# EAGLE schematic minirov (EAGLE 9.1.3)
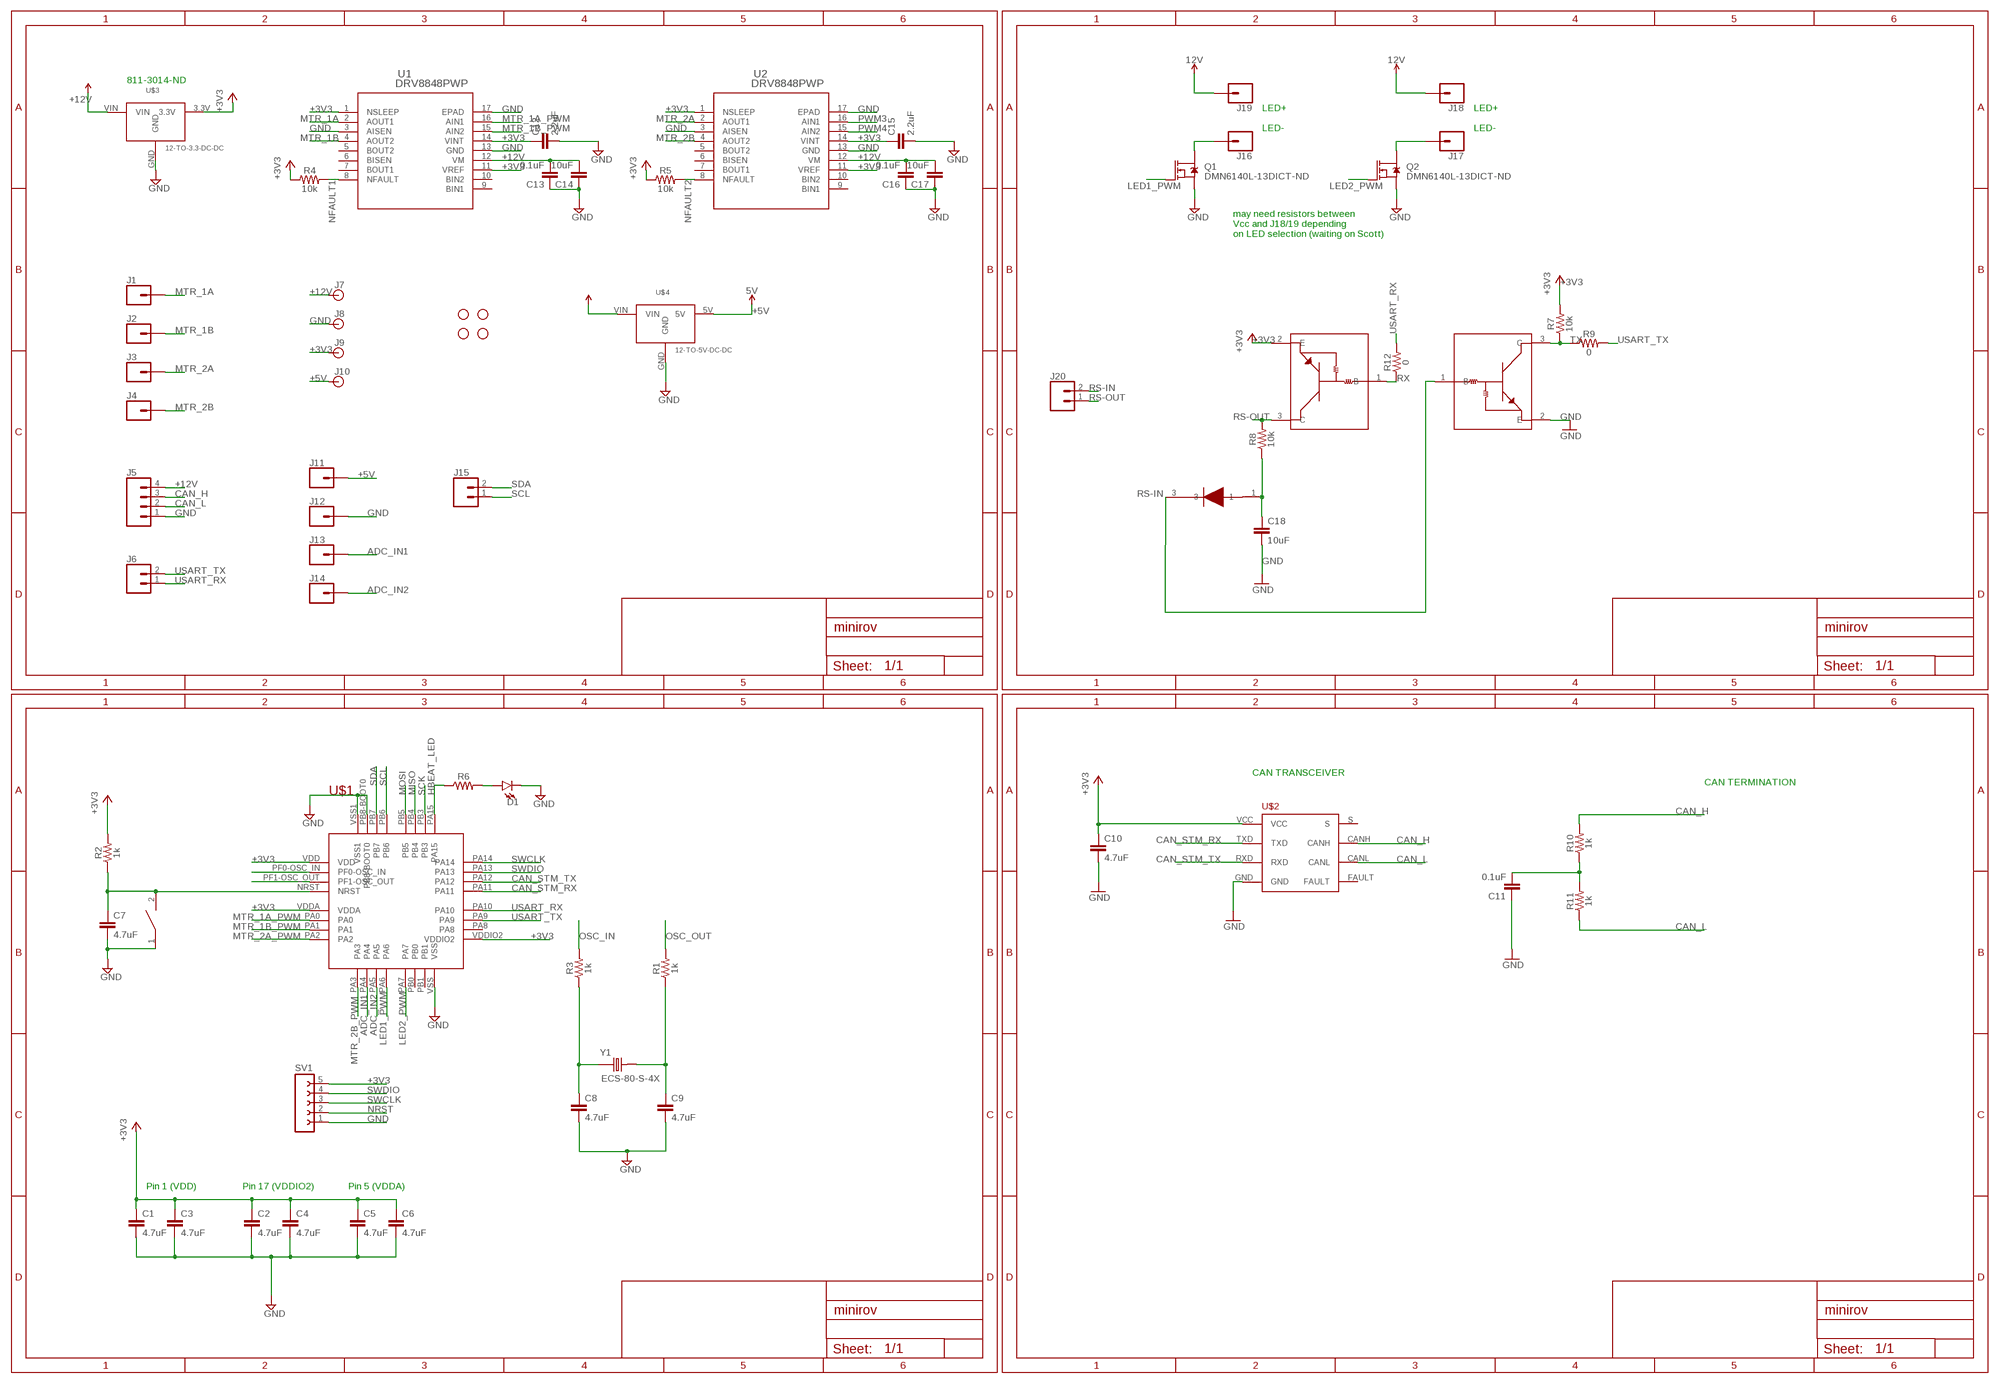
[diagram p0: schematic, sheet 1]

## Parts
C1  4.7uF  4.7UF0603  [0603]
C2  4.7uF  4.7UF0603  [0603]
C3  4.7uF  4.7UF0603  [0603]
C4  4.7uF  4.7UF0603  [0603]
C5  4.7uF  4.7UF0603  [0603]
C6  4.7uF  4.7UF0603  [0603]
C7  4.7uF  4.7UF0603  [0603]
C8  4.7uF  4.7UF0603  [0603]
C9  4.7uF  4.7UF0603  [0603]
C10  4.7uF  4.7UF0603  [0603]
C11  0.1uF  0.1UF-0603-25V-(+80/-20%)  [0603]
C12  2.2uF  0.1UF-0603-25V-(+80/-20%)  [0603]
C13  0.1uF  0.1UF-0603-25V-(+80/-20%)  [0603]
C14  10uF  0.1UF-0603-25V-(+80/-20%)  [0603]
C15  2.2uF  0.1UF-0603-25V-(+80/-20%)  [0603]
C16  0.1uF  0.1UF-0603-25V-(+80/-20%)  [0603]
C17  10uF  0.1UF-0603-25V-(+80/-20%)  [0603]
C18  10uF  10UF-0603-6.3V-20%  [0603]
D1  LED0603  [LED-0603]
H1  STAND-OFF  [STAND-OFF]
H2  STAND-OFF  [STAND-OFF]
H3  STAND-OFF  [STAND-OFF]
H4  STAND-OFF  [STAND-OFF]
J1  CONN_01  [1X01]
J2  CONN_01  [1X01]
J3  CONN_01  [1X01]
J4  CONN_01  [1X01]
J5  CONN_04  [1X04]
J6  CONN_02  [1X02]
J7  BANANA_CONN  [BANANA_CONN]
J8  BANANA_CONN  [BANANA_CONN]
J9  BANANA_CONN  [BANANA_CONN]
J10  BANANA_CONN  [BANANA_CONN]
J11  CONN_01  [1X01]
J12  CONN_01  [1X01]
J13  CONN_01  [1X01]
J14  CONN_01  [1X01]
J15  CONN_02  [1X02]
J16  CONN_01  [1X01]
J17  CONN_01  [1X01]
J18  CONN_01  [1X01]
J19  CONN_01  [1X01]
J20  CONN_02  [1X02]
Q1  DMN6140L-13DICT-ND  DMN6140L-13  [SOT23-3]
Q2  DMN6140L-13DICT-ND  DMN6140L-13  [SOT23-3]
R1  1k  1KOHM-0603-1/10W-1%  [0603]
R2  1k  1KOHM-0603-1/10W-1%  [0603]
R3  1k  1KOHM-0603-1/10W-1%  [0603]
R4  10k  RESISTOR0603  [0603]
R5  10k  RESISTOR0603  [0603]
R6  RESISTOR0603  [0603]
R7  10k  RESISTOR0603  [0603]
R8  10k  RESISTOR0603  [0603]
R9  0  RESISTOR0603  [0603]
R10  1k  1KOHM-0603-1/10W-1%  [0603]
R11  1k  1KOHM-0603-1/10W-1%  [0603]
R12  0  RESISTOR0603  [0603]
RESET  SWITCH  [SW_2512]
SV1  FE05-1  [FE05-1]
U1  DRV8848PWP  [PWP16_2P46X2P31]
U2  DRV8848PWP  [PWP16_2P46X2P31]
U$1  STM32F042K6T6  [STM32F042K6T6]
U$2  TCAN337D  [TCAN337D]
U$3  12-TO-3.3-DC-DC  [MURATA-DCDC]
U$4  12-TO-5V-DC-DC  [MURATA-DCDC_5V]
U$5  UN2112  [SOT23-3]
U$6  UN2212  [SOT23-3]
U$7  BAS16  [BAS16]
Y1  ECS-80-S-4X  [XTAL_ECS-80-S-4X]

## Nets
12V: U$4.VIN
+3V3: C1.1 C2.1 C3.1 C4.1 C5.1 C6.1 C10.1 C12.1 C15.1 J9.P$1 R2.2 R4.1 R5.1 R7.2 SV1.5 U1.1(NSLEEP) U1.11(VREF) U1.14(VINT) U2.1(NSLEEP) U2.11(VREF) U2.14(VINT) U$1.VDD U$1.VDDA U$1.VDDIO2 U$2.VCC U$3.3.3V U$5.2(E)
+5V: J10.P$1 J11.1 U$4.5V ; supply symbol labelled 5V
+12V: C13.2 C14.2 C16.2 C17.2 J5.4 J7.P$1 J18.1 J19.1 U1.12(VM) U2.12(VM) U$3.VIN ; supply symbol labelled 12V
ADC_IN1: J13.1 U$1.PA4
ADC_IN2: J14.1 U$1.PA5
CAN_H: J5.3 R10.2 U$2.CANH
CAN_L: J5.2 R11.1 U$2.CANL
CAN_STM_RX: U$1.PA11 U$2.TXD
CAN_STM_TX: U$1.PA12 U$2.RXD
GND: C1.2 C2.2 C3.2 C4.2 C5.2 C6.2 C7.2 C8.2 C9.2 C10.2 C11.1 C12.2 C13.1 C14.1 C15.2 C16.1 C17.1 C18.2 D1.C J5.1 J8.P$1 J12.1 Q1.2(S) Q2.2(S) RESET.1 SV1.1 U1.3(AISEN) U1.13(GND) U1.17(EPAD) U2.3(AISEN) U2.13(GND) U2.17(EPAD) U$1.PB8-BOOT0 U$1.VSS U$1.VSS1 U$2.GND U$3.GND U$4.GND U$6.2(E)
HBEAT_LED: R6.1 U$1.PA15
LED1_PWM: Q1.1(G) U$1.PA6
LED2_PWM: Q2.1(G) U$1.PA7
MISO: U$1.PB4
MOSI: U$1.PB5
MTR_1A: J1.1 U1.2(AOUT1)
MTR_1A_PWM: U1.16(AIN1) U$1.PA0
MTR_1B: J2.1 U1.4(AOUT2)
MTR_1B_PWM: U1.15(AIN2) U$1.PA1
MTR_2A: J3.1 U2.2(AOUT1)
MTR_2A_PWM: U$1.PA2
MTR_2B: J4.1 U2.4(AOUT2)
MTR_2B_PWM: U$1.PA3
N$1: C9.1 R1.1 Y1.2
N$2: C8.1 R3.1 Y1.1
N$3: C11.2 R10.1 R11.2
N$4: D1.A R6.2
N$5: C18.1 R8.1 U$7.1
N$6: J17.1 Q2.3(D)
N$7: J16.1 Q1.3(D)
NFAULT1: R4.2 U1.8(NFAULT)
NFAULT2: R5.2 U2.8(NFAULT)
NRST: C7.1 R2.1 RESET.2 SV1.2 U$1.NRST
OSC_IN: R3.2 U$1.PF0-OSC_IN
OSC_OUT: R1.2 U$1.PF1-OSC_OUT
PWM3: U2.16(AIN1)
PWM4: U2.15(AIN2)
RS-IN: J20.2 U$6.1(B) U$7.3
RS-OUT: J20.1 R8.2 U$5.3(C)
RX: R12.1 U$5.1(B)
SCK: U$1.PB3
SCL: J15.1 U$1.PB6
SDA: J15.2 U$1.PB7
SWCLK: SV1.3 U$1.PA14
SWDIO: SV1.4 U$1.PA13
TX: R7.1 R9.1 U$6.3(C)
USART_RX: J6.1 R12.2 U$1.PA10
USART_TX: J6.2 R9.2 U$1.PA9
Unconnected: U1.5(BOUT2) U1.6(BISEN) U1.7(BOUT1) U1.9(BIN1) U1.10(BIN2) U2.5(BOUT2) U2.6(BISEN) U2.7(BOUT1) U2.9(BIN1) U2.10(BIN2) U$1.PA8 U$1.PB0 U$1.PB1 U$2.FAULT U$2.S

## Notes on the sheet
- 811-3014-ND
- LED+
  
  LED-
- LED+
  
  LED-
- may need resistors between 
  Vcc and J18/19 depending 
  on LED selection (waiting on Scott)
- CAN TRANSCEIVER
- CAN TERMINATION
- Pin 1 (VDD) | Pin 17 (VDDIO2) | Pin 5 (VDDA)

## Library data of the parts
C1-C10 = SparkFun-Capacitors:4.7UF: 4.7µF ceramic capacitors A capacitor is a passive two-terminal electrical component used to store electrical energy temporarily in an electric field.; PROD_ID: CAP-08280
C11 C13 C16 = SparkFun-Capacitors:0.1UF: 0.1µF ceramic capacitors A capacitor is a passive two-terminal electrical component used to store electrical energy temporarily in an electric field.; PROD_ID: CAP-00810
C12 C14 C15 C17 = SparkFun-Capacitors:0.1UF: 0.1µF ceramic capacitors A capacitor is a passive two-terminal electrical component used to store electrical energy temporarily in an electric field.; PROD_ID: CAP-00810; VALUE: 0.1uF
C18 = SparkFun-Capacitors:10UF: 10.0µF ceramic capacitors A capacitor is a passive two-terminal electrical component used to store electrical energy temporarily in an electric field.; PROD_ID: CAP-11015
D1 = SparkFun-LED:LED: LED (Generic) Standard schematic elements and footprints for 5mm, 3mm, 1206, and 0603 sized LEDs. Generic LEDs with no color specified.
H1-H4 = SparkFun-Hardware:STAND-OFF: Stand Off Drill holes for mechanically mounting via screws, standoffs, etc. Note: Use the keepout ring to avoid running the screw head into surrounding components. Variant Overviews STAND-OFF - Mechanical footprint for a #4 phillips button head screw. STAND-OFF-TIGHT - Mechanical footprint for a #4 phillips button head screw, Example SparkFun Products Screw - Phillips Head (1/4", 4-40, 10 pack) <https://www.sparkfun.com/products/10453> (PRT-10453) Screw - Phillips Head (1/2", 4-40, 10 pack) <https://www.sparkfun.com/products/10452> (PRT-10452) Screw - Phillips Head (3/4", 4-40, 10 pack) <https://www.sparkfun.com/products/10451> (PRT-10451) Screw - Phillips Head (1", 4-40, 10 pack) <https://www.sparkfun.com/products/10450> (PRT-10450)
J1-J4 J11-J14 J16-J19 = SparkFun-Connectors:CONN_01: Single connection point. Often used as Generic Header-pin footprint for 0.1 inch spaced/style header connections On any of the 0.1 inch spaced packages, you can populate with these: Break Away Headers - Straight <https://www.sparkfun.com/products/116> (PRT-00116) Break Away Male Headers - Right Angle <https://www.sparkfun.com/products/553> (PRT-00553) Female Headers <https://www.sparkfun.com/products/115> (PRT-00115) Break Away Headers - Machine Pin <https://www.sparkfun.com/products/117> (PRT-00117) Break Away Female Headers - Swiss Machine Pin <https://www.sparkfun.com/products/743> (PRT-00743) This device is also useful as a general connection point to wire up your design to another part of your project. Our various solder wires solder well into these plated through hole pads. Hook-Up Wire - Assortment (Stranded, 22 AWG) <https://www.sparkfun.com/products/11375> (PRT-11375) Hook-Up Wire - Assortment (Solid Core, 22 AWG) <https://www.sparkfun.com/products/11367> (PRT-11367) View the entire wire category on our website here <https://www.sparkfun.com/categories/141> Special notes: SMTSO-256-ET is a "flush mount" nut for a 4-40 screw. We mostly use this on specialty testbeds; it is a nice way to connect hardware to your PCB at an adjustable hieght. Also note, the SNAP packages are for using a snappable style connector. We sell a baggie of snaps and they are also used on two LilyPad designs: Snap Assortment - 30 pack (male and female) <https://www.sparkfun.com/products/11347> (DEV-11347) LilyPad Arduino SimpleSnap <https://www.sparkfun.com/products/10941> (DEV-10941) LilyPad SimpleSnap Protoboard <https://www.sparkfun.com/products/10940> (DEV-10940)
J5 = SparkFun-Connectors:CONN_04: Multi connection point. Often used as Generic Header-pin footprint for 0.1 inch spaced/style header connections On any of the 0.1 inch spaced packages, you can populate with these: Break Away Headers - Straight <https://www.sparkfun.com/products/116> (PRT-00116) Break Away Male Headers - Right Angle <https://www.sparkfun.com/products/553> (PRT-00553) Female Headers <https://www.sparkfun.com/products/115> (PRT-00115) Break Away Headers - Machine Pin <https://www.sparkfun.com/products/117> (PRT-00117) Break Away Female Headers - Swiss Machine Pin <https://www.sparkfun.com/products/743> (PRT-00743) For SCREWTERMINALS and SPRING TERMINALS visit here: Screw Terimnals on SparkFun.com <https://www.sparkfun.com/search/results?term=Screw+Terminals> (5mm/3.5mm/2.54mm spacing) This device is also useful as a general connection point to wire up your design to another part of your project. Our various solder wires solder well into these plated through hole pads. Hook-Up Wire - Assortment (Stranded, 22 AWG) <https://www.sparkfun.com/products/11375> (PRT-11375) Hook-Up Wire - Assortment (Solid Core, 22 AWG) <https://www.sparkfun.com/products/11367> (PRT-11367) View the entire wire category on our website here <https://www.sparkfun.com/categories/141> Special notes: Molex polarized connector foot print use with SKU : PRT-08231 with associated crimp pins and housings. 1MM SMD Version SKU: PRT-10208; PROD_ID: CONN-09696
J6 J15 J20 = SparkFun-Connectors:CONN_02: Multi connection point. Often used as Generic Header-pin footprint for 0.1 inch spaced/style header connections On any of the 0.1 inch spaced packages, you can populate with these: Break Away Headers - Straight <https://www.sparkfun.com/products/116> (PRT-00116) Break Away Male Headers - Right Angle <https://www.sparkfun.com/products/553> (PRT-00553) Female Headers <https://www.sparkfun.com/products/115> (PRT-00115) Break Away Headers - Machine Pin <https://www.sparkfun.com/products/117> (PRT-00117) Break Away Female Headers - Swiss Machine Pin <https://www.sparkfun.com/products/743> (PRT-00743) For SCREWTERMINALS and SPRING TERMINALS visit here: Screw Terimnals on SparkFun.com <https://www.sparkfun.com/search/results?term=Screw+Terminals> (5mm/3.5mm/2.54mm spacing) This device is also useful as a general connection point to wire up your design to another part of your project. Our various solder wires solder well into these plated through hole pads. Hook-Up Wire - Assortment (Stranded, 22 AWG) <https://www.sparkfun.com/products/11375> (PRT-11375) Hook-Up Wire - Assortment (Solid Core, 22 AWG) <https://www.sparkfun.com/products/11367> (PRT-11367) View the entire wire category on our website here <https://www.sparkfun.com/categories/141> Special notes: Molex polarized connector foot print use with: PRT-08233 with associated crimp pins and housings. 2.54_SCREWTERM for use with PRT-10571. 3.5mm Screw Terminal footprints for PRT-08084 5mm Screw Terminal footprints for use with PRT-08432
J7-J10 = SparkFun-Connectors:BANANA_CONN: Through-hole Banana Jack Basic PTH connection for banana jack plugs SparkFun Products: Multimeter Kit <https://www.sparkfun.com/products/retired/10956> Banana to Alligator Cable <https://www.sparkfun.com/products/retired/509> Banana to Alligator Coax Cable <https://www.sparkfun.com/products/retired/508> Banana to Banana Cable <https://www.sparkfun.com/products/retired/507> Banana to IC Hook Cables <https://www.sparkfun.com/products/retired/506>
Q1 Q2 = minirov:DMN6140L-13: DMN6140L-13DICT-ND
R1-R3 R10 R11 = SparkFun-Resistors:1KOHM: 1kΩ resistor A resistor is a passive two-terminal electrical component that implements electrical resistance as a circuit element. Resistors act to reduce current flow, and, at the same time, act to lower voltage levels within circuits. - Wikipedia; PROD_ID: RES-07856
R4-R9 R12 = SparkFun-Resistors:RESISTOR: Generic Resistor Package
RESET = DiscreteComponents:SWITCH
SV1 = con-lsta:FE05-1: FEMALE HEADER; OC_FARNELL: unknown; OC_NEWARK: unknown
U1 U2 = minirov:DRV8848PWP; MANUFACTURER_PART_NUMBER: DRV8848PWP; VENDOR: Texas Instruments
U$1 = PI_Shield_Library:STM32F042K6T6
U$2 = PI_Shield_Library:TCAN337D
U$3 = minirov:12-TO-3.3-DC-DC
U$4 = minirov:12-TO-5V-DC-DC: 811-2692-ND
U$5 = minirov:UN2112: MMUN2112LT1GOSCT-ND
U$6 = minirov:UN2212: MMUN2212LT1GOSCT-ND
U$7 = minirov:BAS16: BAS16FSCT-ND
Y1 = ECS-80-S-4X:ECS-80-S-4X: CRYSTAL T/H; DESCRIPTION: Crystal 8MHz Series 2-Pin HC-49/U; DIGI-KEY_PART_NUMBER: X1057-ND; DIGI-KEY_PURCHASE_URL: https://www.digikey.com/product-detail/en/ecs-inc/ECS-80-S-4X/X1057-ND/827549?utm_source=snapeda&utm_medium=aggregator&utm_campaign=symbol; MF: ECS International; MP: ECS-80-S-4X; PACKAGE: HC-49/US ECS International